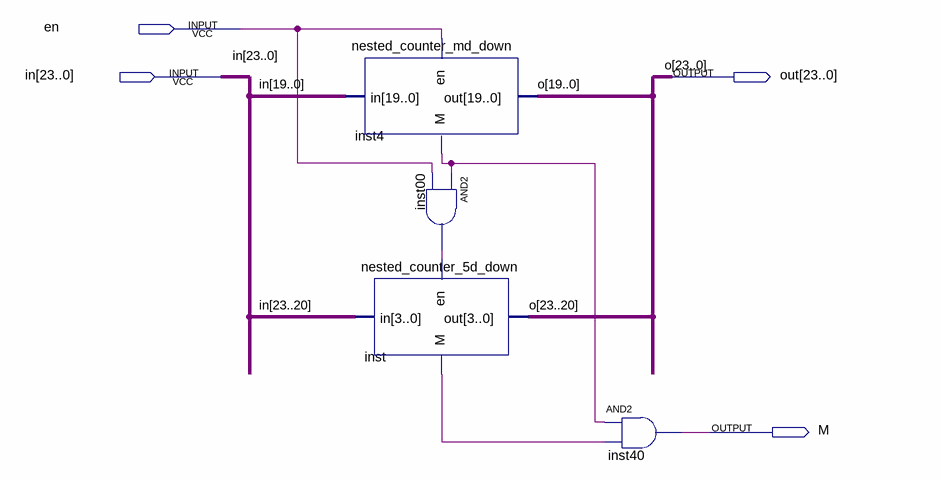
[diagram p0: schematic sheet]
// Quartus schematic nested_counter_5md_down.bdf as structural Verilog: 4 symbols, 4 pins
module nested_counter_5md_down (
  input  en,
  input  [23:0] in,
  output [23:0] out,
  output M
);

  wire inst00_out, inst4_m, inst_m;

  nested_counter_md_down inst4 (.en(en), .in(in[19:0]), .out(out[19:0]), .M(inst4_m));
  and inst00 (inst00_out, inst4_m, en);
  nested_counter_5d_down inst (.en(inst00_out), .in(in[23:20]), .out(out[23:20]), .M(inst_m));
  and inst40 (M, inst4_m, inst_m);

  // Other names for the same wires on the sheet: o[23:0] = out
endmodule
